# EAGLE design piezo-preamp-tickler_V0-9b (EAGLE 7.6.0)
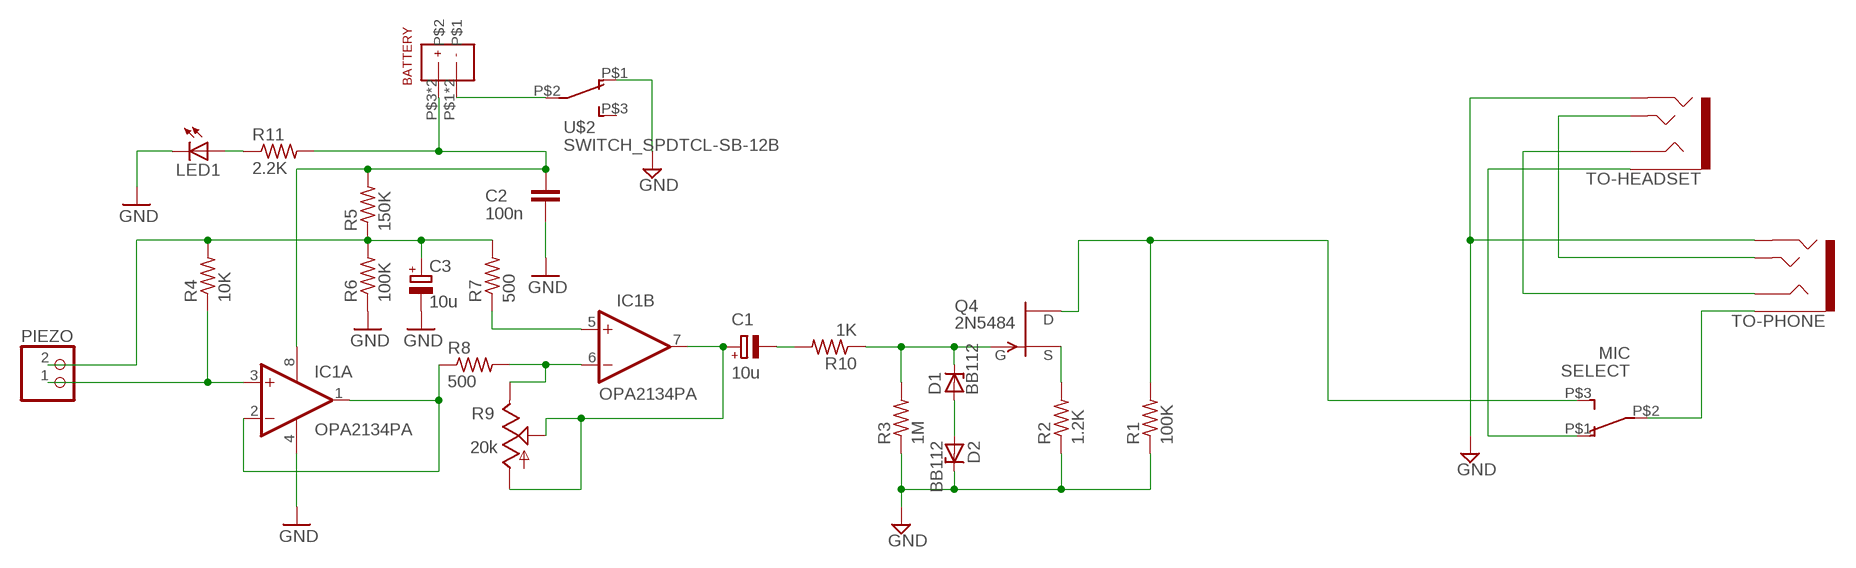
[diagram p0: schematic, sheet 1]

## Parts
BATTERY  BATTERY-A27  [BATTERY-A27-KEYSTONE-3651]
C1  10u  CPOL-EUTT2D5L  [TT2D5L]
C2  100n  C-EU025-025X050  [C025-025X050]
C3  10u  CPOL-EUTT2D5L  [TT2D5L]
D1  BB112  ZENER-DIODEZD-5  [ZDIO-5]
D2  BB112  ZENER-DIODEZD-5  [ZDIO-5]
IC1  OPA2134PA  [DIL08]
LED1  LED3MM  [LED3MM]
PIEZO  JST_2PIN-THM  [JST-PH-2-THM]
Q4  2N5484  [TO92-]
R1  100K  R-US_0204/7  [0204/7]
R2  1.2K  R-US_0204/7  [0204/7]
R3  1M  R-US_0204/7  [0204/7]
R4  10K  R-US_0204/7  [0204/7]
R5  150K  R-US_0204/7  [0204/7]
R6  100K  R-US_0204/7  [0204/7]
R7  500  R-US_0204/7  [0204/7]
R8  500  R-US_0204/7  [0204/7]
R9  20k  TRIMPOT-BOURNS  [TRIMPOT-BOURNS-3306F]
R10  1K  R-US_0204/7  [0204/7]
R11  2.2K  R-US_0204/7  [0204/7]
SELECT  MIC  SWITCH_SPDTCL-SB-12B  [SWITCH_SPDT_CL-SB-12B]
TO-HEADSET  AUDIO-JACK3LGPADS  [AUDIO-JACK-TRRS-SMD]
TO-PHONE  AUDIO-JACK3LGPADS  [AUDIO-JACK-TRRS-SMD]
U$2  SWITCH_SPDTCL-SB-12B  [SWITCH_SPDT_CL-SB-12B]

## Nets
GND: C2.1 C3.- D2.C IC1.4(A:V-) LED1.K(C) R1.1 R2.1 R3.1 R6.1 TO-HEADSET.RING2 TO-PHONE.RING2 U$2.P$1
N$1: D1.A D2.A
N$2: BATTERY.P$1 BATTERY.P$2 U$2.P$2
N$3: Q4.2(S) R2.2
N$5: IC1.5(B:+IN) R7.1
N$6: C1.+ IC1.7(B:OUT) R9.P$1(IN) R9.P$2(WIPER)
N$7: IC1.6(B:-IN) R8.2 R9.P$3(OUT)
N$8: C3.+ PIEZO.2 R4.2 R5.1 R6.2 R7.2
N$9: IC1.3(A:+IN) PIEZO.1 R4.1
N$10: D1.C Q4.1(G) R3.2 R10.1
N$11: C1.- R10.2
N$12: SELECT.P$1 TO-HEADSET.EARTH
N$13: TO-HEADSET.TIP TO-PHONE.TIP
N$14: IC1.1(A:OUT) IC1.2(A:-IN) R8.1
N$15: TO-HEADSET.RING1 TO-PHONE.RING1
N$16: LED1.A R11.1
N$17: SELECT.P$2 TO-PHONE.EARTH
SELECT: Q4.3(D) R1.2 SELECT.P$3
V9V: BATTERY.P$3 BATTERY.P$4 C2.2 IC1.8(A:V+) R5.2 R11.2
Unconnected: U$2.P$3

## Library data of the parts
BATTERY = CMU-ArtFab:BATTERY-A27
C1 C3 = rcl:CPOL-EU: POLARIZED CAPACITOR, European symbol
C2 = rcl:C-EU: CAPACITOR, European symbol
D1 D2 = diode:ZENER-DIODE: Z-Diode
IC1 = linear:OPA2*: Dual Operational Amplifier Low Power, Single-Supply, Rail-To-Rail Operational Amplifier Source: http://focus.ti.com/lit/ds/symlink/opa2345.pdf http://focus.ti.com .. opa241.pdf http://focus.ti.com/lit/ds/symlink/opa2134.pdf
LED1 = led:LED: LED OSRAM: - CHIPLED LG R971, LG N971, LY N971, LG Q971, LY Q971, LO R971, LY R971 LH N974, LH R974 LS Q976, LO Q976, LY Q976 LO Q996 - Hyper CHIPLED LW Q18S LB Q993, LB Q99A, LB R99A - SideLED LS A670, LO A670, LY A670, LG A670, LP A670 LB A673, LV A673, LT A673, LW A673 LH A674 LY A675 LS A676, LA A676, LO A676, LY A676, LW A676 LS A679, LY A679, LG A679 - Hyper Micro SIDELED® LS Y876, LA Y876, LO Y876, LY Y876 LT Y87S - SmartLED LW L88C, LW L88S LB L89C, LB L89S, LG L890 LS L89K, LO L89K, LY L89K LS L896, LA L896, LO L896, LY L896 - TOPLED LS T670, LO T670, LY T670, LG T670, LP T670 LSG T670, LSP T670, LSY T670, LOP T670, LYG T670 LG T671, LOG T671, LSG T671 LB T673, LV T673, LT T673, LW T673 LH T674 LS T676, LA T676, LO T676, LY T676, LB T676, LH T676, LSB T676, LW T676 LB T67C, LV T67C, LT T67C, LS T67K, LO T67K, LY T67K, LW E67C LS E67B, LA E67B, LO E67B, LY E67B, LB E67C, LV E67C, LT E67C LW T67C LS T679, LY T679, LG T679 LS T770, LO T770, LY T770, LG T770, LP T770 LB T773, LV T773, LT T773, LW T773 LH T774 LS E675, LA E675, LY E675, LS T675 LS T776, LA T776, LO T776, LY T776, LB T776 LHGB T686 LT T68C, LB T68C - Hyper Mini TOPLED® LB M676 - Mini TOPLED Santana® LG M470 LS M47K, LO M47K, LY M47K Source: http://www.osram.convergy.de LUXEON: - LUMILED® LXK2-PW12-R00, LXK2-PW12-S00, LXK2-PW14-U00, LXK2-PW14-V00 LXK2-PM12-R00, LXK2-PM12-S00, LXK2-PM14-U00 LXK2-PE12-Q00, LXK2-PE12-R00, LXK2-PE12-S00, LXK2-PE14-T00, LXK2-PE14-U00 LXK2-PB12-K00, LXK2-PB12-L00, LXK2-PB12-M00, LXK2-PB14-N00, LXK2-PB14-P00, LXK2-PB14-Q00 LXK2-PR12-L00, LXK2-PR12-M00, LXK2-PR14-Q00, LXK2-PR14-R00 LXK2-PD12-Q00, LXK2-PD12-R00, LXK2-PD12-S00 LXK2-PH12-R00, LXK2-PH12-S00 LXK2-PL12-P00, LXK2-PL12-Q00, LXK2-PL12-R00 Source: www.luxeon.com KINGBRIGHT: KA-3528ASYC Source: www.kingbright.com
PIEZO = adafruit:JST_2PIN: JST 2-Pin Connectors of various flavors SMT-RA (S2B-PH-SM4) 4UConnector #17311 SMT (B2B-PH-SM4) THM-RA (S2B-PH) THM (B2B-PH)
Q4 = transistor-fet:?548*: N-Channel JFETs Source: VISHAY 2N5484.pdf Compatible: TO92 2N5245 J304 J305 U310 J308 J309 J310 TO72 2N4416 2N4416A 2N3823 2N4351 3N169 3N170 3N171 MFE3002 TO18 2N3796 2N3797 MFE825 Source: Motorola European Master Guide Pacge 3-59
R1-R8 R10 R11 = CMU-ArtFab:R-US_: RESISTOR, American symbol
R9 = CMU-ArtFab:TRIMPOT-BOURNS
SELECT U$2 = CMU-ArtFab:SWITCH_SPDT
TO-HEADSET TO-PHONE = Daniel:AUDIO-JACK3: Audio jack - 3.5mm TRRS variety - two rings.

## Net classes
0 default: width 0.152 mm, clearance 0.2 mm

## Board
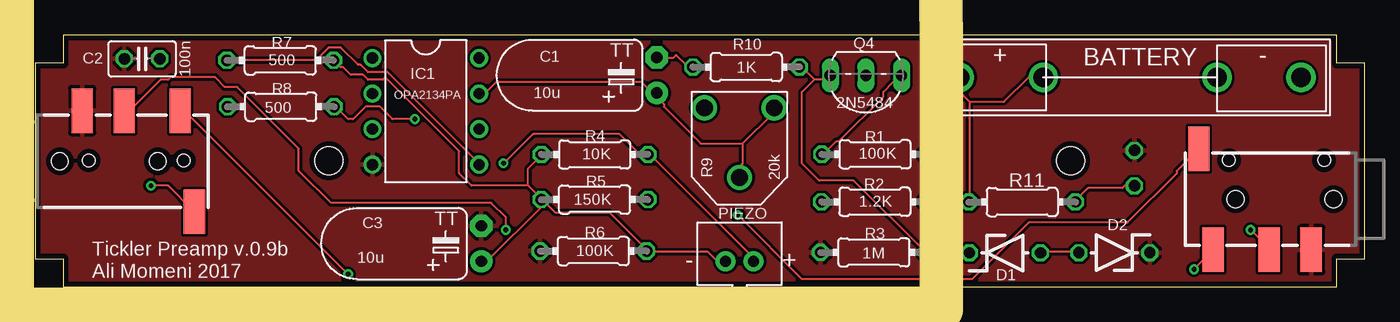
[diagram p1: board, top side]
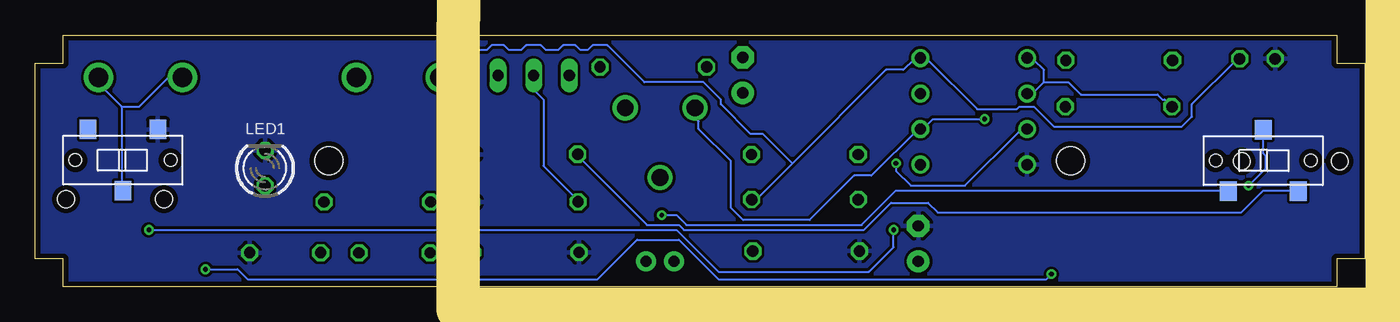
[diagram p2: board, bottom side, seen from below]

Size 95 x 18 mm. Coordinates in mm from the lower left corner, seen from the top.
Outline: 2,0 93,0 93,2 95,2 95,16 93,16 93,18 2,18 2,16 0,16 0,2 2,2 2,0
Copper layers (1*16): Top 0.0356mm / dielectric 1.5011mm / Bottom 0.0356mm
Design rules "oshpark-2layer": minimum track width 6mil, minimum drill 13mil, track to track 6mil, track to pad 6mil, pad to pad 6mil, via to via 6mil, smd to smd 6mil, copper to edge 15mil, drill to drill 6mil, minimum pad ring 7mil, minimum via ring 7mil, stop-mask expansion 2.5mil, vias tented up to drill 0mil, thermal gap 10mil
Holes 2 mm at 21,9 74,9
Milling: 4 lines

### Footprints (pad centres in the part's own frame; a part is rotated, then mirrored left to right if it is on the bottom)
BATTERY-A27-KEYSTONE-3651 = drill 1.4: P$1 6,0; P$2 0,0; P$3 -18.4,0; P$4 -12.4,0
TT2D5L = drill 0.813 pad 1.6: + -1.27,0 | drill 0.813 pad 1.6 octagon: - 1.27,0
C025-025X050 = drill 0.813 octagon: 1 -1.27,0; 2 1.27,0
ZDIO-5 = drill 0.813 octagon: A 2.54,0; C -2.54,0
DIL08 = drill 0.813 pad 1.27: 1 -3.81,-3.81; 2 -1.27,-3.81; 3 1.27,-3.81; 4 3.81,-3.81; 5 3.81,3.81; 6 1.27,3.81; 7 -1.27,3.81; 8 -3.81,3.81
LED3MM = drill 0.813 octagon: A -1.27,0; K 1.27,0
JST-PH-2-THM = drill 0.8 pad 1.422: 1 1,0; 2 -1,0
TO92- = drill 0.813 long: 1 2.54,0; 2 0,0; 3 -2.54,0
0204/7 = drill 0.813 octagon: 1 -3.81,0; 2 3.81,0
TRIMPOT-BOURNS-3306F = drill 1.2: P$1 0.01,0; P$2 2.5,4.99; P$3 4.99,0
SWITCH_SPDT_CL-SB-12B = smd 1.2 x 1.4: P$1 -2.5,-2.2; P$2 0,2.2; P$3 2.5,-2.2 | hole 0.9: -3.4,0; 3.4,0
AUDIO-JACK-TRRS-SMD = smd 1.524 x 3.175: EARTH 11.227,-3.619; RING1 6.2,3.619; RING2 3.2,3.619; TIP 10.2,3.619 | hole 1.2: 1.6,0; 8.6,0

### Placement (x,y rotation side)
BATTERY  84.45,14.95 0 top
C1  44.43,15.12 90 top
C2  7.66,16.29 0 top
C3  31.89,3.07 90 top
D1  69.31,2.41 0 top
D2  77.12,2.42 180 top
IC1  27.92,12.54 270 top
LED1  78.57,8.48 90 bottom
PIEZO  50.34,1.81 0 top
Q4  59.37,15.1 180 top
R1  60.03,9.46 180 top
R2  60.01,6.07 180 top
R3  59.94,2.44 0 top
R4  39.99,9.45 180 top
R5  39.98,6.22 0 top
R6  39.9,2.54 0 top
R7  17.52,16.18 0 top
R8  17.57,12.87 0 top
R9  52.83,12.79 180 top
R10  50.82,15.7 180 top
R11  70.54,6.05 180 top
SELECT  7.24,9.02 0 bottom
TO-HEADSET  94.39,6.25 180 top
TO-PHONE  0.17,8.97 0 top
U$2  88.72,9.04 180 bottom

### Tracks (layer width: path | path; a pad name or v marks a point on that pad's centre or on a via)
GND
  pour Top: -1,19.03 96,19.03 96,-0.97 -1,-0.97
  pour Bottom: -1,19.03 96,19.03 96,-0.97 -1,-0.97
N$1
  Top 0.152: D1.A 71.89,2.47 74.53,2.47 D2.A
N$2
  Bottom 0.152: 88.81,12.86 88.81,6.87 U$2.P$2 | 88.81,12.86 90.39,14.45 90.39,14.8 BATTERY.P$1 | 88.81,12.86 87.57,12.86 85.46,14.98 84.58,14.98 BATTERY.P$2
N$3
  Bottom 0.152: R2.2 56.21,6.17 58.67,8.63 58.67,13.39 59.2,13.92 59.2,14.98 Q4.2
N$5
  Top 0.152: R7.1 13.74,16.03 14.8,16.03 14.98,16.21 20.09,16.21 20.97,17.09 21.85,17.09 23.08,15.86 23.26,15.86 23.79,15.33 25.2,15.33 31.72,8.81 IC1.5
N$6
  Top 0.152: 50.57,10.22 50.57,8.81 50.39,8.63 50.39,7.93 R9.P$2 | 50.57,10.22 52.68,12.33 52.68,12.69 R9.P$1 | IC1.7 31.89,13.92 32.24,13.92 32.95,14.62 43.34,14.62 44.05,13.92 44.4,13.92 C1.+ 44.58,13.74 44.58,13.39 44.93,13.04 44.93,12.86 47.57,10.22 50.57,10.22
N$7  (via drill 0.33)
  Top 0.152: v27.14,11.98 25.55,11.98 24.67,12.86 23.61,12.86 22.73,11.98 22.38,11.98 21.5,12.86 R8.2
  Bottom 0.152: v27.14,11.98 30.84,11.98 31.72,11.1 IC1.6 31.89,11.28 35.24,7.93 36.47,7.93 39.65,4.76 44.4,4.76 45.28,5.64 45.28,8.99 47.57,11.28 47.57,11.8 47.75,11.98 47.75,12.69 R9.P$3
N$8
  Top 0.152: PIEZO.2 49.34,1.94 48.63,1.94 48.1,2.47 43.87,2.47 R6.2 43.7,2.64 41.05,5.29 37.18,5.29 36.3,6.17 R5.1 | 35.24,7.22 31.19,7.22 30.31,8.11 30.31,9.69 25.02,14.98 24.84,14.8 23.79,14.8 23.43,15.15 22.55,15.15 22.02,15.68 21.85,15.68 21.5,16.03 R7.2 | 35.24,7.22 36.12,6.34 R5.1 | 35.24,7.22 35.24,8.46 36.12,9.34 R4.2 | C3.+ 31.89,1.94 32.42,1.94 36.12,5.64 36.12,6.17 R5.1
N$9  (via drill 0.33)
  Top 0.152: PIEZO.1 51.45,1.94 44.05,9.34 43.87,9.34 R4.1 43.7,9.52 43.17,9.52 41.76,10.92 35.59,10.92 v33.48,8.81
  Bottom 0.152: v33.48,8.81 33.48,8.28 32.42,7.22 28.54,7.22 24.67,11.1 24.14,11.1 IC1.3
N$10
  Top 0.152: 55.68,14.8 54.8,15.68 R10.1 | 55.68,14.8 56.56,14.8 56.74,14.98 Q4.1 | D1.C 66.6,2.47 65.02,2.47 64.84,2.29 63.78,2.29 R3.2 63.61,2.47 58.5,7.58 56.03,7.58 54.8,8.81 54.8,13.92 55.68,14.8
N$11
  Top 0.152: R10.2 46.87,15.86 46.52,15.86 45.81,16.56 45.64,16.39 44.58,16.39 C1.-
N$12  (via drill 0.33)
  Top 0.152: v50.22,5.11 54.8,0.53 66.96,0.53 71.01,4.58 78.06,4.58 81.58,8.11 81.58,8.28 TO-HEADSET.EARTH
  Bottom 0.152: v50.22,5.11 49.16,5.11 48.45,4.41 35.95,4.41 33.48,6.87 9.87,6.87 SELECT.P$1
N$13  (via drill 0.33)
  Top 0.152: v22.38,0.88 10.75,12.51 10.4,12.51 TO-PHONE.TIP | v82.81,1.23 84.05,2.47 TO-HEADSET.TIP
  Bottom 0.152: v22.38,0.88 22.73,0.53 46.16,0.53 48.98,3.35 51.98,3.35 54.8,0.53 79.82,0.53 80.52,1.23 v82.81,1.23
N$14
  Bottom 0.152: 22.91,14.62 21.14,14.62 20.26,13.74 14.8,13.74 14.45,13.39 14.27,13.39 13.92,13.04 R8.1 | 22.91,14.62 23.61,13.92 23.96,13.92 IC1.2 | 22.91,14.62 22.91,15.51 23.61,16.21 23.96,16.21 IC1.1
N$15  (via drill 0.33)
  Top 0.152: v33.65,4.05 33.65,4.93 32.6,5.99 21.14,5.99 18.85,8.28 18.85,9.87 14.45,14.27 13.57,14.27 12.86,14.98 9.69,14.98 9.52,14.8 8.99,14.8 6.87,12.69 6.52,12.69 TO-PHONE.RING1 | v86.87,4.05 88.28,2.64 TO-HEADSET.RING1
  Bottom 0.152: v33.65,4.05 33.65,2.82 35.42,1.06 46.16,1.06 49.16,4.05 v86.87,4.05
N$16
  Top 0.152: R11.1 74.36,6.17 75.24,7.05 77.7,7.05 77.88,7.22 78.41,7.22 LED1.A
N$17  (via drill 0.33)
  Top 0.152: v8.28,7.22 9.52,7.22 11.28,5.46 TO-PHONE.EARTH
  Bottom 0.152: v8.28,7.22 7.05,8.46 7.05,9.34 7.22,9.52 7.22,11.1 SELECT.P$2
SELECT
  Top 0.152: Q4.3 61.85,14.98 61.49,14.62 61.32,14.62 60.61,13.92 60.61,13.57 57.44,10.4 57.27,10.4 56.38,9.52 R1.2
  Bottom 0.152: SELECT.P$3 4.76,6.87 7.22,6.87 8.81,5.29 30.48,5.29 31.19,5.99 33.83,5.99 35.77,4.05 48.63,4.05 48.98,4.41 51.27,4.41 56.21,9.34 R1.2
V9V
  Top 0.152: 66.78,13.21 66.78,6.17 R11.2 | 66.78,13.21 66.08,13.92 66.08,14.8 BATTERY.P$3 | 66.78,13.21 69.25,13.21 71.01,14.98 71.89,14.98 BATTERY.P$4
  Bottom 0.152: C2.2 8.99,16.21 9.16,16.21 12.33,13.04 12.33,12.16 13.04,11.45 22.2,11.45 23.61,12.86 24.67,12.86 24.84,12.69 27.66,12.69 31.19,16.21 31.72,16.21 IC1.8 31.89,16.21 32.24,16.21 32.95,15.51 34.18,15.51 40.88,8.81 | 40.88,8.81 43.34,6.34 43.7,6.34 R5.2 | 40.88,8.81 42.99,10.92 43.87,10.92 45.99,13.04 45.99,13.39 47.22,14.62 51.45,14.62 54.09,17.27 55.15,17.27 55.5,16.91 56.03,16.91 56.38,17.27 57.27,17.27 57.62,16.91 58.5,16.91 58.85,17.27 59.91,17.27 60.26,16.91 61.14,16.91 61.49,17.27 62.38,17.27 62.73,16.91 63.61,16.91 65.55,14.98 65.9,14.98 BATTERY.P$3

### Text on the board
tNames: Tickler Preamp v.0.9b | Ali Momeni 2017